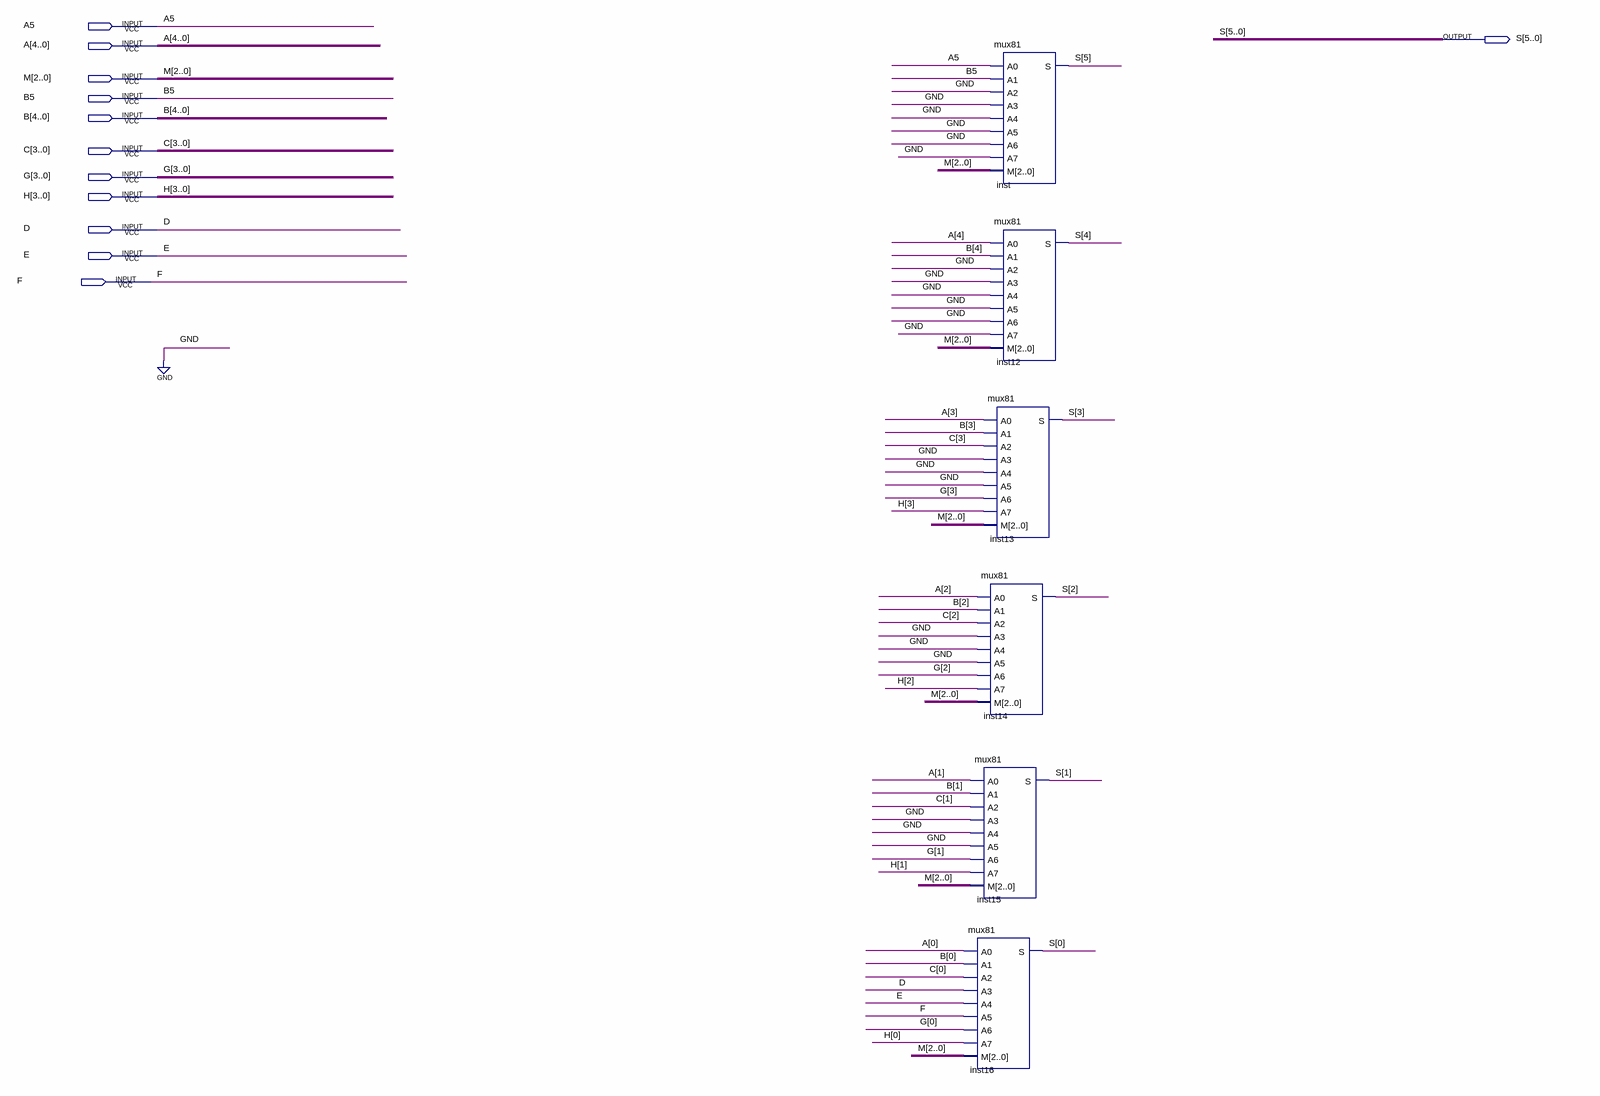
[diagram p0: schematic sheet]
// Quartus schematic muxcompleto.bdf as structural Verilog: 6 symbols, 12 pins
module muxcompleto (
  input  A5,
  input  [4:0] A,
  input  [2:0] M,
  input  B5,
  input  [4:0] B,
  input  [3:0] C,
  input  [3:0] G,
  input  [3:0] H,
  input  D,
  input  E,
  input  F,
  output [5:0] S
);

  mux81 inst (.A0(A5), .A1(B5), .A2(1'b0), .A3(1'b0), .A4(1'b0), .A5(1'b0), .A6(1'b0), .A7(1'b0), .M(M), .S(S[5]));
  mux81 inst12 (
    .A0(A[4]), .A1(B[4]), .A2(1'b0), .A3(1'b0), .A4(1'b0), .A5(1'b0), .A6(1'b0), .A7(1'b0), .M(M), .S(S[4]));
  mux81 inst13 (
    .A0(A[3]), .A1(B[3]), .A2(C[3]), .A3(1'b0), .A4(1'b0), .A5(1'b0), .A6(G[3]), .A7(H[3]), .M(M), .S(S[3]));
  mux81 inst14 (
    .A0(A[2]), .A1(B[2]), .A2(C[2]), .A3(1'b0), .A4(1'b0), .A5(1'b0), .A6(G[2]), .A7(H[2]), .M(M), .S(S[2]));
  mux81 inst15 (
    .A0(A[1]), .A1(B[1]), .A2(C[1]), .A3(1'b0), .A4(1'b0), .A5(1'b0), .A6(G[1]), .A7(H[1]), .M(M), .S(S[1]));
  mux81 inst16 (.A0(A[0]), .A1(B[0]), .A2(C[0]), .A3(D), .A4(E), .A5(F), .A6(G[0]), .A7(H[0]), .M(M), .S(S[0]));
endmodule
